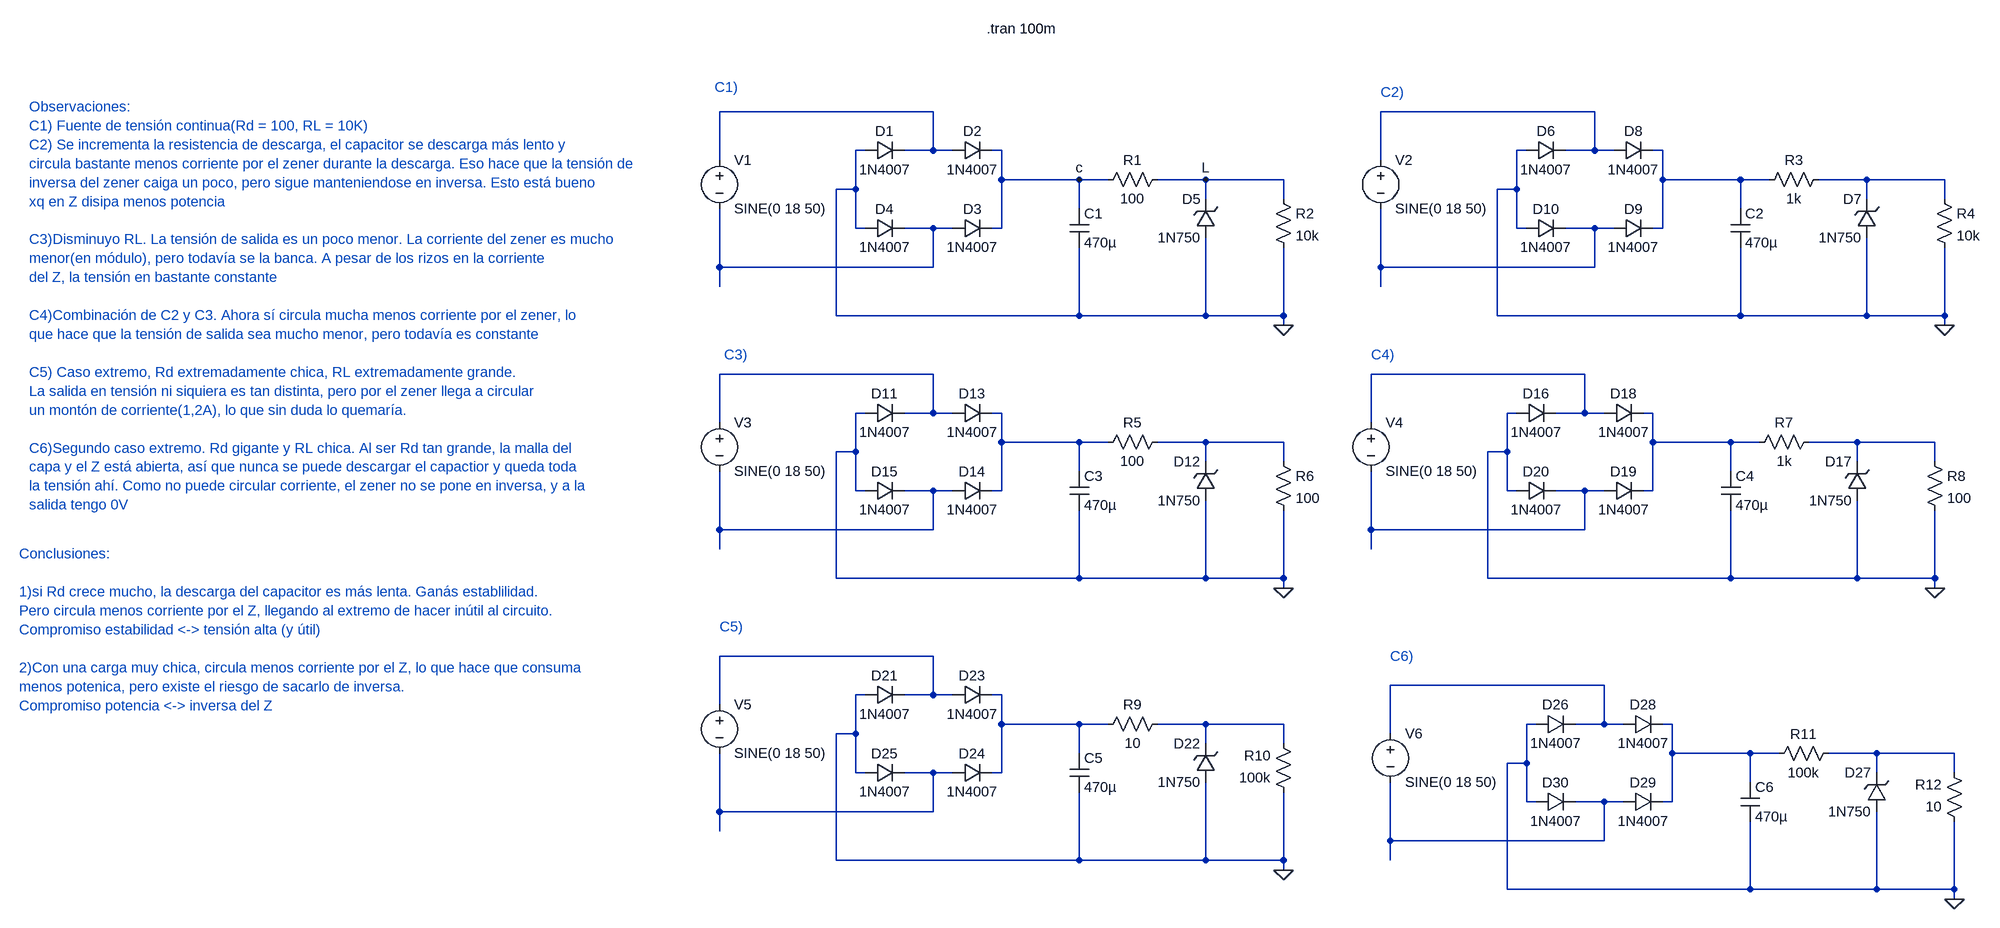
[diagram p0: schematic Simu ej#8.asc]
Simu ej#8.asc, the LTspice schematic file:
Version 4
SHEET 1 1812 1348
WIRE 80 32 -272 32
WIRE 1168 32 816 32
WIRE -32 96 -48 96
WIRE 80 96 80 32
WIRE 80 96 32 96
WIRE 112 96 80 96
WIRE 192 96 176 96
WIRE 1056 96 1040 96
WIRE 1168 96 1168 32
WIRE 1168 96 1120 96
WIRE 1200 96 1168 96
WIRE 1280 96 1264 96
WIRE -272 112 -272 32
WIRE 816 112 816 32
WIRE 192 144 192 96
WIRE 320 144 192 144
WIRE 368 144 320 144
WIRE 528 144 448 144
WIRE 656 144 528 144
WIRE 1280 144 1280 96
WIRE 1408 144 1280 144
WIRE 1456 144 1408 144
WIRE 1616 144 1536 144
WIRE 1744 144 1616 144
WIRE -48 160 -48 96
WIRE -48 160 -80 160
WIRE 1040 160 1040 96
WIRE 1040 160 1008 160
WIRE 528 176 528 144
WIRE 656 176 656 144
WIRE 1616 176 1616 144
WIRE 1744 176 1744 144
WIRE 320 192 320 144
WIRE 1408 192 1408 144
WIRE -48 224 -48 160
WIRE -32 224 -48 224
WIRE 80 224 32 224
WIRE 112 224 80 224
WIRE 192 224 192 144
WIRE 192 224 176 224
WIRE 1040 224 1040 160
WIRE 1056 224 1040 224
WIRE 1168 224 1120 224
WIRE 1200 224 1168 224
WIRE 1280 224 1280 144
WIRE 1280 224 1264 224
WIRE -272 288 -272 192
WIRE 80 288 80 224
WIRE 80 288 -272 288
WIRE 816 288 816 192
WIRE 1168 288 1168 224
WIRE 1168 288 816 288
WIRE -272 320 -272 288
WIRE 816 320 816 288
WIRE -80 368 -80 160
WIRE 320 368 320 256
WIRE 320 368 -80 368
WIRE 528 368 528 240
WIRE 528 368 320 368
WIRE 656 368 656 256
WIRE 656 368 528 368
WIRE 1008 368 1008 160
WIRE 1408 368 1408 256
WIRE 1408 368 1008 368
WIRE 1616 368 1616 240
WIRE 1616 368 1408 368
WIRE 1744 368 1744 256
WIRE 1744 368 1616 368
WIRE 656 384 656 368
WIRE 1744 384 1744 368
WIRE 80 464 -272 464
WIRE 1152 464 800 464
WIRE -32 528 -48 528
WIRE 80 528 80 464
WIRE 80 528 32 528
WIRE 112 528 80 528
WIRE 192 528 176 528
WIRE 1040 528 1024 528
WIRE 1152 528 1152 464
WIRE 1152 528 1104 528
WIRE 1184 528 1152 528
WIRE 1264 528 1248 528
WIRE -272 544 -272 464
WIRE 800 544 800 464
WIRE 192 576 192 528
WIRE 320 576 192 576
WIRE 368 576 320 576
WIRE 528 576 448 576
WIRE 656 576 528 576
WIRE 1264 576 1264 528
WIRE 1392 576 1264 576
WIRE 1440 576 1392 576
WIRE 1600 576 1520 576
WIRE 1728 576 1600 576
WIRE -48 592 -48 528
WIRE -48 592 -80 592
WIRE 1024 592 1024 528
WIRE 1024 592 992 592
WIRE 528 608 528 576
WIRE 656 608 656 576
WIRE 1600 608 1600 576
WIRE 1728 608 1728 576
WIRE 320 624 320 576
WIRE 1392 624 1392 576
WIRE -48 656 -48 592
WIRE -32 656 -48 656
WIRE 80 656 32 656
WIRE 112 656 80 656
WIRE 192 656 192 576
WIRE 192 656 176 656
WIRE 1024 656 1024 592
WIRE 1040 656 1024 656
WIRE 1152 656 1104 656
WIRE 1184 656 1152 656
WIRE 1264 656 1264 576
WIRE 1264 656 1248 656
WIRE -272 720 -272 624
WIRE 80 720 80 656
WIRE 80 720 -272 720
WIRE 800 720 800 624
WIRE 1152 720 1152 656
WIRE 1152 720 800 720
WIRE -272 752 -272 720
WIRE 800 752 800 720
WIRE -80 800 -80 592
WIRE 320 800 320 688
WIRE 320 800 -80 800
WIRE 528 800 528 672
WIRE 528 800 320 800
WIRE 656 800 656 688
WIRE 656 800 528 800
WIRE 992 800 992 592
WIRE 1392 800 1392 688
WIRE 1392 800 992 800
WIRE 1600 800 1600 672
WIRE 1600 800 1392 800
WIRE 1728 800 1728 688
WIRE 1728 800 1600 800
WIRE 656 816 656 800
WIRE 1728 816 1728 800
WIRE 80 928 -272 928
WIRE 1184 976 832 976
WIRE -32 992 -48 992
WIRE 80 992 80 928
WIRE 80 992 32 992
WIRE 112 992 80 992
WIRE 192 992 176 992
WIRE -272 1008 -272 928
WIRE 192 1040 192 992
WIRE 320 1040 192 1040
WIRE 368 1040 320 1040
WIRE 528 1040 448 1040
WIRE 656 1040 528 1040
WIRE 1072 1040 1056 1040
WIRE 1184 1040 1184 976
WIRE 1184 1040 1136 1040
WIRE 1216 1040 1184 1040
WIRE 1296 1040 1280 1040
WIRE -48 1056 -48 992
WIRE -48 1056 -80 1056
WIRE 832 1056 832 976
WIRE 528 1072 528 1040
WIRE 656 1072 656 1040
WIRE 320 1088 320 1040
WIRE 1296 1088 1296 1040
WIRE 1424 1088 1296 1088
WIRE 1472 1088 1424 1088
WIRE 1632 1088 1552 1088
WIRE 1760 1088 1632 1088
WIRE 1056 1104 1056 1040
WIRE 1056 1104 1024 1104
WIRE -48 1120 -48 1056
WIRE -32 1120 -48 1120
WIRE 80 1120 32 1120
WIRE 112 1120 80 1120
WIRE 192 1120 192 1040
WIRE 192 1120 176 1120
WIRE 1632 1120 1632 1088
WIRE 1760 1120 1760 1088
WIRE 1424 1136 1424 1088
WIRE 1056 1168 1056 1104
WIRE 1072 1168 1056 1168
WIRE 1184 1168 1136 1168
WIRE 1216 1168 1184 1168
WIRE 1296 1168 1296 1088
WIRE 1296 1168 1280 1168
WIRE -272 1184 -272 1088
WIRE 80 1184 80 1120
WIRE 80 1184 -272 1184
WIRE -272 1216 -272 1184
WIRE 832 1232 832 1136
WIRE 1184 1232 1184 1168
WIRE 1184 1232 832 1232
WIRE -80 1264 -80 1056
WIRE 320 1264 320 1152
WIRE 320 1264 -80 1264
WIRE 528 1264 528 1136
WIRE 528 1264 320 1264
WIRE 656 1264 656 1152
WIRE 656 1264 528 1264
WIRE 832 1264 832 1232
WIRE 656 1280 656 1264
WIRE 1024 1312 1024 1104
WIRE 1424 1312 1424 1200
WIRE 1424 1312 1024 1312
WIRE 1632 1312 1632 1184
WIRE 1632 1312 1424 1312
WIRE 1760 1312 1760 1200
WIRE 1760 1312 1632 1312
WIRE 1760 1328 1760 1312
FLAG 656 384 0
FLAG 320 144 c
FLAG 528 144 L
FLAG 1744 384 0
FLAG 656 816 0
FLAG 1728 816 0
FLAG 656 1280 0
FLAG 1760 1328 0
SYMBOL diode -32 112 R270
WINDOW 0 32 32 VTop 2
WINDOW 3 0 32 VBottom 2
SYMATTR InstName D1
SYMATTR Value 1N4007
SYMBOL voltage -272 96 R0
WINDOW 123 0 0 Left 0
WINDOW 39 0 0 Left 0
SYMATTR InstName V1
SYMATTR Value SINE(0 18 50)
SYMBOL cap 304 192 R0
SYMATTR InstName C1
SYMATTR Value 470µ
SYMBOL res 464 128 R90
WINDOW 0 0 56 VBottom 2
WINDOW 3 32 56 VTop 2
SYMATTR InstName R1
SYMATTR Value 100
SYMBOL zener 544 240 R180
WINDOW 0 24 64 Left 2
WINDOW 3 24 0 Left 2
SYMATTR InstName D5
SYMATTR Value 1N750
SYMBOL res 640 160 R0
SYMATTR InstName R2
SYMATTR Value 10k
SYMBOL diode 112 112 R270
WINDOW 0 32 32 VTop 2
WINDOW 3 0 32 VBottom 2
SYMATTR InstName D2
SYMATTR Value 1N4007
SYMBOL diode 112 240 R270
WINDOW 0 32 32 VTop 2
WINDOW 3 0 32 VBottom 2
SYMATTR InstName D3
SYMATTR Value 1N4007
SYMBOL diode -32 240 R270
WINDOW 0 32 32 VTop 2
WINDOW 3 0 32 VBottom 2
SYMATTR InstName D4
SYMATTR Value 1N4007
SYMBOL diode 1056 112 R270
WINDOW 0 32 32 VTop 2
WINDOW 3 0 32 VBottom 2
SYMATTR InstName D6
SYMATTR Value 1N4007
SYMBOL voltage 816 96 R0
WINDOW 123 0 0 Left 0
WINDOW 39 0 0 Left 0
SYMATTR InstName V2
SYMATTR Value SINE(0 18 50)
SYMBOL cap 1392 192 R0
SYMATTR InstName C2
SYMATTR Value 470µ
SYMBOL res 1552 128 R90
WINDOW 0 0 56 VBottom 2
WINDOW 3 32 56 VTop 2
SYMATTR InstName R3
SYMATTR Value 1k
SYMBOL zener 1632 240 R180
WINDOW 0 24 64 Left 2
WINDOW 3 24 0 Left 2
SYMATTR InstName D7
SYMATTR Value 1N750
SYMBOL res 1728 160 R0
SYMATTR InstName R4
SYMATTR Value 10k
SYMBOL diode 1200 112 R270
WINDOW 0 32 32 VTop 2
WINDOW 3 0 32 VBottom 2
SYMATTR InstName D8
SYMATTR Value 1N4007
SYMBOL diode 1200 240 R270
WINDOW 0 32 32 VTop 2
WINDOW 3 0 32 VBottom 2
SYMATTR InstName D9
SYMATTR Value 1N4007
SYMBOL diode 1056 240 R270
WINDOW 0 32 32 VTop 2
WINDOW 3 0 32 VBottom 2
SYMATTR InstName D10
SYMATTR Value 1N4007
SYMBOL diode -32 544 R270
WINDOW 0 32 32 VTop 2
WINDOW 3 0 32 VBottom 2
SYMATTR InstName D11
SYMATTR Value 1N4007
SYMBOL voltage -272 528 R0
WINDOW 123 0 0 Left 0
WINDOW 39 0 0 Left 0
SYMATTR InstName V3
SYMATTR Value SINE(0 18 50)
SYMBOL cap 304 624 R0
SYMATTR InstName C3
SYMATTR Value 470µ
SYMBOL res 464 560 R90
WINDOW 0 0 56 VBottom 2
WINDOW 3 32 56 VTop 2
SYMATTR InstName R5
SYMATTR Value 100
SYMBOL zener 544 672 R180
WINDOW 0 24 64 Left 2
WINDOW 3 24 0 Left 2
SYMATTR InstName D12
SYMATTR Value 1N750
SYMBOL res 640 592 R0
SYMATTR InstName R6
SYMATTR Value 100
SYMBOL diode 112 544 R270
WINDOW 0 32 32 VTop 2
WINDOW 3 0 32 VBottom 2
SYMATTR InstName D13
SYMATTR Value 1N4007
SYMBOL diode 112 672 R270
WINDOW 0 32 32 VTop 2
WINDOW 3 0 32 VBottom 2
SYMATTR InstName D14
SYMATTR Value 1N4007
SYMBOL diode -32 672 R270
WINDOW 0 32 32 VTop 2
WINDOW 3 0 32 VBottom 2
SYMATTR InstName D15
SYMATTR Value 1N4007
SYMBOL diode 1040 544 R270
WINDOW 0 32 32 VTop 2
WINDOW 3 0 32 VBottom 2
SYMATTR InstName D16
SYMATTR Value 1N4007
SYMBOL voltage 800 528 R0
WINDOW 123 0 0 Left 0
WINDOW 39 0 0 Left 0
SYMATTR InstName V4
SYMATTR Value SINE(0 18 50)
SYMBOL cap 1376 624 R0
SYMATTR InstName C4
SYMATTR Value 470µ
SYMBOL res 1536 560 R90
WINDOW 0 0 56 VBottom 2
WINDOW 3 32 56 VTop 2
SYMATTR InstName R7
SYMATTR Value 1k
SYMBOL zener 1616 672 R180
WINDOW 0 24 64 Left 2
WINDOW 3 24 0 Left 2
SYMATTR InstName D17
SYMATTR Value 1N750
SYMBOL res 1712 592 R0
SYMATTR InstName R8
SYMATTR Value 100
SYMBOL diode 1184 544 R270
WINDOW 0 32 32 VTop 2
WINDOW 3 0 32 VBottom 2
SYMATTR InstName D18
SYMATTR Value 1N4007
SYMBOL diode 1184 672 R270
WINDOW 0 32 32 VTop 2
WINDOW 3 0 32 VBottom 2
SYMATTR InstName D19
SYMATTR Value 1N4007
SYMBOL diode 1040 672 R270
WINDOW 0 32 32 VTop 2
WINDOW 3 0 32 VBottom 2
SYMATTR InstName D20
SYMATTR Value 1N4007
SYMBOL diode -32 1008 R270
WINDOW 0 32 32 VTop 2
WINDOW 3 0 32 VBottom 2
SYMATTR InstName D21
SYMATTR Value 1N4007
SYMBOL voltage -272 992 R0
WINDOW 123 0 0 Left 0
WINDOW 39 0 0 Left 0
SYMATTR InstName V5
SYMATTR Value SINE(0 18 50)
SYMBOL cap 304 1088 R0
SYMATTR InstName C5
SYMATTR Value 470µ
SYMBOL zener 544 1136 R180
WINDOW 0 24 64 Left 2
WINDOW 3 24 0 Left 2
SYMATTR InstName D22
SYMATTR Value 1N750
SYMBOL diode 112 1008 R270
WINDOW 0 32 32 VTop 2
WINDOW 3 0 32 VBottom 2
SYMATTR InstName D23
SYMATTR Value 1N4007
SYMBOL diode 112 1136 R270
WINDOW 0 32 32 VTop 2
WINDOW 3 0 32 VBottom 2
SYMATTR InstName D24
SYMATTR Value 1N4007
SYMBOL diode -32 1136 R270
WINDOW 0 32 32 VTop 2
WINDOW 3 0 32 VBottom 2
SYMATTR InstName D25
SYMATTR Value 1N4007
SYMBOL res 464 1024 R90
WINDOW 0 0 56 VBottom 2
WINDOW 3 32 56 VTop 2
SYMATTR InstName R9
SYMATTR Value 10
SYMBOL res 672 1168 R180
WINDOW 0 36 76 Left 2
WINDOW 3 36 40 Left 2
SYMATTR InstName R10
SYMATTR Value 100k
SYMBOL diode 1072 1056 R270
WINDOW 0 32 32 VTop 2
WINDOW 3 0 32 VBottom 2
SYMATTR InstName D26
SYMATTR Value 1N4007
SYMBOL voltage 832 1040 R0
WINDOW 123 0 0 Left 0
WINDOW 39 0 0 Left 0
SYMATTR InstName V6
SYMATTR Value SINE(0 18 50)
SYMBOL cap 1408 1136 R0
SYMATTR InstName C6
SYMATTR Value 470µ
SYMBOL zener 1648 1184 R180
WINDOW 0 24 64 Left 2
WINDOW 3 24 0 Left 2
SYMATTR InstName D27
SYMATTR Value 1N750
SYMBOL diode 1216 1056 R270
WINDOW 0 32 32 VTop 2
WINDOW 3 0 32 VBottom 2
SYMATTR InstName D28
SYMATTR Value 1N4007
SYMBOL diode 1216 1184 R270
WINDOW 0 32 32 VTop 2
WINDOW 3 0 32 VBottom 2
SYMATTR InstName D29
SYMATTR Value 1N4007
SYMBOL diode 1072 1184 R270
WINDOW 0 32 32 VTop 2
WINDOW 3 0 32 VBottom 2
SYMATTR InstName D30
SYMATTR Value 1N4007
SYMBOL res 1568 1072 R90
WINDOW 0 0 56 VBottom 2
WINDOW 3 32 56 VTop 2
SYMATTR InstName R11
SYMATTR Value 100k
SYMBOL res 1776 1216 R180
WINDOW 0 36 76 Left 2
WINDOW 3 36 40 Left 2
SYMATTR InstName R12
SYMATTR Value 10
TEXT 168 -104 Left 2 !.tran 100m
TEXT -1408 24 Left 2 ;Observaciones:\nC1) Fuente de tensión continua(Rd = 100, RL = 10K)\nC2) Se incrementa la resistencia de descarga, el capacitor se descarga más lento y \ncircula bastante menos corriente por el zener durante la descarga. Eso hace que la tensión de\ninversa del zener caiga un poco, pero sigue manteniendose en inversa. Esto está bueno\nxq en Z disipa menos potencia\n \nC3)Disminuyo RL. La tensión de salida es un poco menor. La corriente del zener es mucho\nmenor(en módulo), pero todavía se la banca. A pesar de los rizos en la corriente\ndel Z, la tensión en bastante constante\n \nC4)Combinación de C2 y C3. Ahora sí circula mucha menos corriente por el zener, lo\nque hace que la tensión de salida sea mucho menor, pero todavía es constante\n \nC5) Caso extremo, Rd extremadamente chica, RL extremadamente grande.\nLa salida en tensión ni siquiera es tan distinta, pero por el zener llega a circular\nun montón de corriente(1,2A), lo que sin duda lo quemaría.\n \nC6)Segundo caso extremo. Rd gigante y RL chica. Al ser Rd tan grande, la malla del\ncapa y el Z está abierta, así que nunca se puede descargar el capactior y queda toda\nla tensión ahí. Como no puede circular corriente, el zener no se pone en inversa, y a la\nsalida tengo 0V
TEXT -280 -8 Left 2 ;C1)
TEXT 816 0 Left 2 ;C2)
TEXT -264 432 Left 2 ;C3)
TEXT 800 432 Left 2 ;C4)
TEXT -272 880 Left 2 ;C5)
TEXT 832 928 Left 2 ;C6)
TEXT -1424 760 Left 2 ;Conclusiones: \n \n1)si Rd crece mucho, la descarga del capacitor es más lenta. Ganás establilidad.\nPero circula menos corriente por el Z, llegando al extremo de hacer inútil al circuito.\nCompromiso estabilidad <-> tensión alta (y útil)\n \n2)Con una carga muy chica, circula menos corriente por el Z, lo que hace que consuma\nmenos potenica, pero existe el riesgo de sacarlo de inversa. \nCompromiso potencia <-> inversa del Z

The netlist it stands for:
* Simu ej#8.asc
D1 0 N001 1N4007
V1 N001 N005 SINE(0 18 50)
C1 c 0 470µ
R1 L c 100
D5 0 L 1N750
R2 L 0 10k
D2 N001 c 1N4007
D3 N005 c 1N4007
D4 0 N005 1N4007
D6 0 N002 1N4007
V2 N002 N006 SINE(0 18 50)
C2 N003 0 470µ
R3 N004 N003 1k
D7 0 N004 1N750
R4 N004 0 10k
D8 N002 N003 1N4007
D9 N006 N003 1N4007
D10 0 N006 1N4007
D11 0 N007 1N4007
V3 N007 N013 SINE(0 18 50)
C3 N009 0 470µ
R5 N011 N009 100
D12 0 N011 1N750
R6 N011 0 100
D13 N007 N009 1N4007
D14 N013 N009 1N4007
D15 0 N013 1N4007
D16 0 N008 1N4007
V4 N008 N014 SINE(0 18 50)
C4 N010 0 470µ
R7 N012 N010 1k
D17 0 N012 1N750
R8 N012 0 100
D18 N008 N010 1N4007
D19 N014 N010 1N4007
D20 0 N014 1N4007
D21 0 N015 1N4007
V5 N015 N021 SINE(0 18 50)
C5 N017 0 470µ
D22 0 N018 1N750
D23 N015 N017 1N4007
D24 N021 N017 1N4007
D25 0 N021 1N4007
R9 N018 N017 10
R10 0 N018 100k
D26 0 N016 1N4007
V6 N016 N022 SINE(0 18 50)
C6 N019 0 470µ
D27 0 N020 1N750
D28 N016 N019 1N4007
D29 N022 N019 1N4007
D30 0 N022 1N4007
R11 N020 N019 100k
R12 0 N020 10
.model D D
.lib standard.dio
.tran 100m
* Observaciones:
* C1) Fuente de tensión continua(Rd = 100, RL = 10K)
* C2) Se incrementa la resistencia de descarga, el capacitor se descarga más lento y
* circula bastante menos corriente por el zener durante la descarga. Eso hace que la tensión de
* inversa del zener caiga un poco, pero sigue manteniendose en inversa. Esto está bueno
* xq en Z disipa menos potencia
* C3)Disminuyo RL. La tensión de salida es un poco menor. La corriente del zener es mucho
* menor(en módulo), pero todavía se la banca. A pesar de los rizos en la corriente
* del Z, la tensión en bastante constante
* C4)Combinación de C2 y C3. Ahora sí circula mucha menos corriente por el zener, lo
* que hace que la tensión de salida sea mucho menor, pero todavía es constante
* C5) Caso extremo, Rd extremadamente chica, RL extremadamente grande.
* La salida en tensión ni siquiera es tan distinta, pero por el zener llega a circular
* un montón de corriente(1,2A), lo que sin duda lo quemaría.
* C6)Segundo caso extremo. Rd gigante y RL chica. Al ser Rd tan grande, la malla del
* capa y el Z está abierta, así que nunca se puede descargar el capactior y queda toda
* la tensión ahí. Como no puede circular corriente, el zener no se pone en inversa, y a la
* salida tengo 0V
* C1)
* C2)
* C3)
* C4)
* C5)
* C6)
* Conclusiones:
* 1)si Rd crece mucho, la descarga del capacitor es más lenta. Ganás establilidad.
* Pero circula menos corriente por el Z, llegando al extremo de hacer inútil al circuito.
* Compromiso estabilidad <-> tensión alta (y útil)
* 2)Con una carga muy chica, circula menos corriente por el Z, lo que hace que consuma
* menos potenica, pero existe el riesgo de sacarlo de inversa.
* Compromiso potencia <-> inversa del Z
.backanno
.end